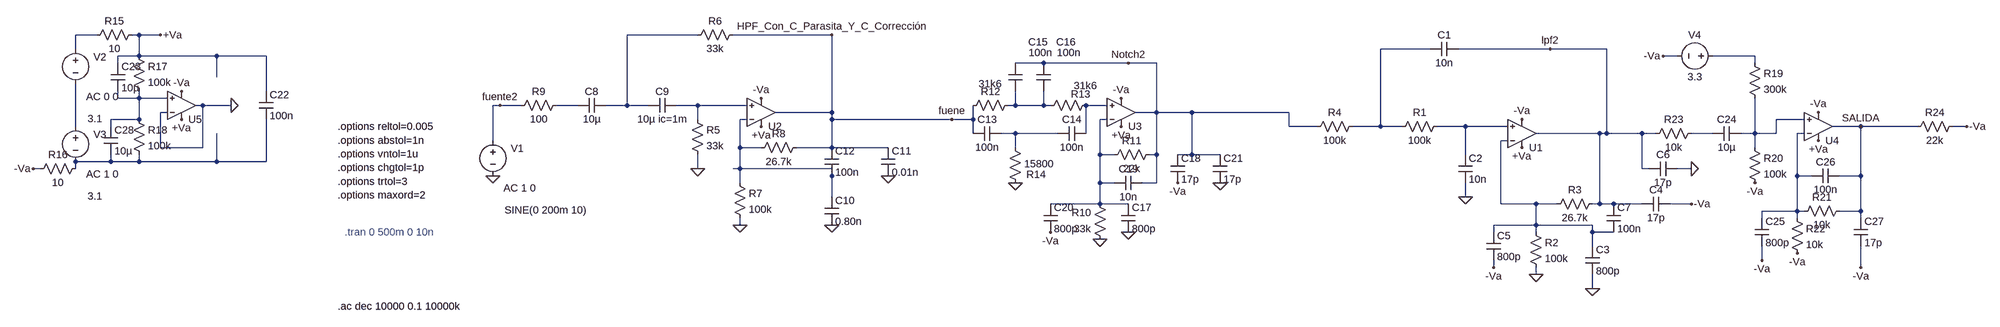
[diagram p0: schematic Draft2_porLaChita_Denuuevo_NoLepusiste_NOmBre_a_la_W_E_B_A_D_A.asc]
Draft2_porLaChita_Denuuevo_NoLepusiste_NOmBre_a_la_W_E_B_A_D_A.asc, the LTspice schematic file:
Version 4
SHEET 1 2632 900
WIRE -1760 -64 -1808 -64
WIRE -1664 -64 -1680 -64
WIRE -1616 -64 -1664 -64
WIRE -320 -64 -480 -64
WIRE -16 -64 -240 -64
WIRE -1808 -32 -1808 -64
WIRE 1360 -32 1248 -32
WIRE 1632 -32 1424 -32
WIRE 1760 -32 1632 -32
WIRE -1664 -16 -1664 -64
WIRE -1664 -16 -1712 -16
WIRE -1488 -16 -1664 -16
WIRE -1376 -16 -1488 -16
WIRE 1920 -16 1888 -16
WIRE 2096 -16 2000 -16
WIRE -1712 0 -1712 -16
WIRE 464 0 400 0
WIRE 656 0 464 0
WIRE 720 0 656 0
WIRE 2096 0 2096 -16
WIRE -1488 32 -1488 -16
WIRE -1376 64 -1376 -16
WIRE -1712 80 -1712 64
WIRE -1664 80 -1664 64
WIRE -1664 80 -1712 80
WIRE -1600 80 -1664 80
WIRE -1520 96 -1536 96
WIRE -1456 96 -1520 96
WIRE -768 96 -784 96
WIRE -720 96 -768 96
WIRE -592 96 -640 96
WIRE -480 96 -480 -64
WIRE -480 96 -528 96
WIRE -432 96 -480 96
WIRE -320 96 -368 96
WIRE -208 96 -320 96
WIRE 400 96 400 64
WIRE 400 96 384 96
WIRE 464 96 464 64
WIRE 464 96 400 96
WIRE 480 96 464 96
WIRE 608 96 560 96
WIRE -1600 112 -1616 112
WIRE -16 112 -16 -64
WIRE -16 112 -144 112
WIRE 720 112 720 0
WIRE 720 112 672 112
WIRE 800 112 720 112
WIRE 1040 112 800 112
WIRE -1664 128 -1664 80
WIRE -1664 128 -1728 128
WIRE -320 128 -320 96
WIRE -208 128 -224 128
WIRE -16 128 -16 112
WIRE 256 128 -16 128
WIRE 304 128 304 96
WIRE 304 128 256 128
WIRE 608 128 592 128
WIRE 2208 128 2144 128
WIRE -1808 144 -1808 48
WIRE -1728 144 -1728 128
WIRE 1040 144 1040 112
WIRE 1104 144 1040 144
WIRE 1248 144 1248 -32
WIRE 1248 144 1184 144
WIRE 1296 144 1248 144
WIRE 1440 144 1376 144
WIRE 1536 144 1440 144
WIRE 2336 144 2272 144
WIRE 2464 144 2336 144
WIRE 2576 144 2544 144
WIRE 304 160 304 128
WIRE 400 160 368 160
WIRE 496 160 400 160
WIRE 560 160 560 96
WIRE 1744 160 1600 160
WIRE 1760 160 1760 -32
WIRE 1760 160 1744 160
WIRE 1840 160 1760 160
WIRE 1872 160 1840 160
WIRE 2000 160 1952 160
WIRE 2096 160 2096 80
WIRE 2096 160 2064 160
WIRE 2144 160 2144 128
WIRE 2144 160 2096 160
WIRE 2208 160 2192 160
WIRE -784 176 -784 96
WIRE 1536 176 1520 176
WIRE -1616 192 -1616 112
WIRE -1520 192 -1520 96
WIRE -1520 192 -1616 192
WIRE -224 192 -224 128
WIRE -176 192 -224 192
WIRE -16 192 -16 128
WIRE -16 192 -96 192
WIRE 112 192 -16 192
WIRE 400 192 400 160
WIRE 2096 192 2096 160
WIRE 592 208 592 128
WIRE 624 208 592 208
WIRE 720 208 720 112
WIRE 720 208 704 208
WIRE 800 208 800 112
WIRE 800 208 768 208
WIRE 864 208 800 208
WIRE 1440 208 1440 144
WIRE -1728 224 -1728 208
WIRE -1728 224 -1808 224
WIRE -1664 224 -1664 208
WIRE -1664 224 -1728 224
WIRE -1488 224 -1488 160
WIRE -1488 224 -1664 224
WIRE -1376 224 -1376 128
WIRE -1376 224 -1488 224
WIRE -1888 240 -1904 240
WIRE -1808 240 -1808 224
WIRE -320 240 -320 208
WIRE -224 240 -224 192
WIRE -224 240 -240 240
WIRE -16 240 -224 240
WIRE 1840 240 1840 160
WIRE 1856 240 1840 240
WIRE 1952 240 1920 240
WIRE -16 256 -16 240
WIRE 2192 256 2192 160
WIRE 2224 256 2192 256
WIRE 2336 256 2336 144
WIRE 2336 256 2288 256
WIRE -224 272 -224 240
WIRE 592 272 592 208
WIRE 624 272 592 272
WIRE 720 272 720 208
WIRE 720 272 688 272
WIRE -16 304 -16 256
WIRE 1440 304 1440 272
WIRE 592 320 592 272
WIRE 592 320 480 320
WIRE 656 320 592 320
WIRE 1520 320 1520 176
WIRE 1600 320 1520 320
WIRE 1648 320 1600 320
WIRE 1744 320 1744 160
WIRE 1744 320 1728 320
WIRE 1776 320 1744 320
WIRE 1840 320 1776 320
WIRE 1952 320 1904 320
WIRE 2192 336 2192 256
WIRE 2192 336 2112 336
WIRE 2208 336 2192 336
WIRE 2336 336 2336 256
WIRE 2336 336 2288 336
WIRE 2112 352 2112 336
WIRE 2192 352 2192 336
WIRE 2336 352 2336 336
WIRE -224 368 -224 352
WIRE 1600 368 1600 320
WIRE 1600 368 1504 368
WIRE 1728 368 1600 368
WIRE 1504 384 1504 368
WIRE 1600 384 1600 368
WIRE 1728 384 1728 368
WIRE 1776 384 1728 384
WIRE 1728 416 1728 384
WIRE 2112 448 2112 416
WIRE 1504 464 1504 448
WIRE 2336 464 2336 416
WIRE 1600 480 1600 464
WIRE 1728 512 1728 480
FLAG 1568 192 +Va
FLAG 1568 128 -Va
FLAG 1440 304 0
FLAG 1600 480 0
FLAG 1632 -32 lpf2
FLAG 1728 512 0
FLAG 1952 320 -Va
FLAG 1952 240 0
FLAG 1504 464 -Va
FLAG -320 240 0
FLAG -176 144 +Va
FLAG -176 80 -Va
FLAG -16 -64 HPF_Con_C_Parasita_Y_C_Corrección
FLAG -224 368 0
FLAG -784 256 0
FLAG -768 96 fuente2
FLAG -16 368 0
FLAG 112 256 0
FLAG 592 400 0
FLAG 640 80 -Va
FLAG 640 144 +Va
FLAG 656 0 Notch2
FLAG 400 272 0
FLAG 256 128 fuene
FLAG 656 384 0
FLAG 864 272 0
FLAG 480 384 -Va
FLAG 768 272 -Va
FLAG -1456 96 0
FLAG -1904 240 -Va
FLAG -1616 -64 +Va
FLAG 2240 112 -Va
FLAG 2240 176 +Va
FLAG -1568 128 +Va
FLAG -1568 64 -Va
FLAG 2096 272 -Va
FLAG 1888 -16 -Va
FLAG 2112 448 -Va
FLAG 2192 432 -Va
FLAG 2336 144 SALIDA
FLAG 2576 144 -Va
FLAG 2336 464 -Va
SYMBOL res 1392 128 R90
WINDOW 0 0 56 VBottom 2
WINDOW 3 32 56 VTop 2
SYMATTR InstName R1
SYMATTR Value 100k
SYMBOL cap 1424 -48 R90
WINDOW 0 0 32 VBottom 2
WINDOW 3 32 32 VTop 2
SYMATTR InstName C1
SYMATTR Value 10n
SYMBOL cap 1424 208 R0
SYMATTR InstName C2
SYMATTR Value 10n
SYMBOL OpAmps\\UniversalOpAmp2 1568 160 M180
SYMATTR InstName U1
SYMBOL res 1584 368 R0
SYMATTR InstName R2
SYMATTR Value 100k
SYMBOL res 1744 304 R90
WINDOW 0 0 56 VBottom 2
WINDOW 3 32 56 VTop 2
SYMATTR InstName R3
SYMATTR Value 26.7k
SYMBOL cap 1712 416 R0
SYMATTR InstName C3
SYMATTR Value 800p
SYMBOL cap 1904 304 R90
WINDOW 0 0 32 VBottom 2
WINDOW 3 32 32 VTop 2
SYMATTR InstName C4
SYMATTR Value 17p
SYMBOL res 1200 128 R90
WINDOW 0 0 56 VBottom 2
WINDOW 3 32 56 VTop 2
SYMATTR InstName R4
SYMATTR Value 100k
SYMBOL cap 1488 384 R0
SYMATTR InstName C5
SYMATTR Value 800p
SYMBOL cap 1920 224 R90
WINDOW 0 0 32 VBottom 2
WINDOW 3 32 32 VTop 2
SYMATTR InstName C6
SYMATTR Value 17p
SYMBOL cap 1760 320 R0
SYMATTR InstName C7
SYMATTR Value 100n
SYMBOL cap -528 80 R90
WINDOW 0 0 32 VBottom 2
WINDOW 3 32 32 VTop 2
SYMATTR InstName C8
SYMATTR Value 10µ
SYMBOL cap -368 80 R90
WINDOW 0 0 32 VBottom 2
WINDOW 3 32 32 VTop 2
SYMATTR InstName C9
SYMATTR Value 10µ ic=1m
SYMBOL res -336 112 R0
SYMATTR InstName R5
SYMATTR Value 33k
SYMBOL res -224 -80 R90
WINDOW 0 0 56 VBottom 2
WINDOW 3 32 56 VTop 2
SYMATTR InstName R6
SYMATTR Value 33k
SYMBOL OpAmps\\UniversalOpAmp2 -176 112 M180
SYMATTR InstName U2
SYMBOL res -240 256 R0
SYMATTR InstName R7
SYMATTR Value 100k
SYMBOL res -80 176 R90
WINDOW 0 0 56 VBottom 2
WINDOW 3 32 56 VTop 2
SYMATTR InstName R8
SYMATTR Value 26.7k
SYMBOL voltage -784 160 R0
WINDOW 0 41 34 Left 2
WINDOW 123 24 124 Left 2
WINDOW 39 0 0 Left 0
WINDOW 3 27 174 Left 2
SYMATTR InstName V1
SYMATTR Value2 AC 1 0
SYMATTR Value SINE(0 200m 10)
SYMBOL res -624 80 R90
WINDOW 0 0 56 VBottom 2
WINDOW 3 32 56 VTop 2
SYMATTR InstName R9
SYMATTR Value 100
SYMBOL cap -32 304 R0
SYMATTR InstName C10
SYMATTR Value 0.80n
SYMBOL cap 96 192 R0
SYMATTR InstName C11
SYMATTR Value 0.01n
SYMBOL cap -32 192 R0
SYMATTR InstName C12
SYMATTR Value 100n
SYMBOL OpAmps\\UniversalOpAmp2 640 112 M180
SYMATTR InstName U3
SYMBOL res 608 416 R180
WINDOW 0 36 76 Left 2
WINDOW 3 36 40 Left 2
SYMATTR InstName R10
SYMATTR Value 33k
SYMBOL res 720 192 R90
WINDOW 0 0 56 VBottom 2
WINDOW 3 32 56 VTop 2
SYMATTR InstName R11
SYMATTR Value 22k
SYMBOL res 400 80 R90
WINDOW 0 0 56 VBottom 2
WINDOW 3 -48 57 VTop 2
SYMATTR InstName R12
SYMATTR Value 31k6
SYMBOL res 576 80 R90
WINDOW 0 6 28 VBottom 2
WINDOW 3 -44 17 VTop 2
SYMATTR InstName R13
SYMATTR Value 31k6
SYMBOL cap 368 144 R90
WINDOW 0 0 32 VBottom 2
WINDOW 3 32 32 VTop 2
SYMATTR InstName C13
SYMATTR Value 100n
SYMBOL cap 560 144 R90
WINDOW 0 0 32 VBottom 2
WINDOW 3 32 32 VTop 2
SYMATTR InstName C14
SYMATTR Value 100n
SYMBOL cap 384 0 R0
WINDOW 3 46 -24 Left 2
WINDOW 0 45 -48 Left 2
SYMATTR Value 100n
SYMATTR InstName C15
SYMBOL res 384 176 R0
WINDOW 0 41 77 Left 2
WINDOW 3 36 53 Left 2
SYMATTR InstName R14
SYMATTR Value 15800
SYMBOL cap 448 0 R0
WINDOW 3 46 -24 Left 2
WINDOW 0 45 -48 Left 2
SYMATTR Value 100n
SYMATTR InstName C16
SYMBOL cap 640 320 R0
SYMATTR InstName C17
SYMATTR Value 800p
SYMBOL cap 752 208 R0
SYMATTR InstName C18
SYMATTR Value 17p
SYMBOL cap 688 256 R90
WINDOW 0 0 32 VBottom 2
WINDOW 3 32 32 VTop 2
SYMATTR InstName C19
SYMATTR Value 10n
SYMBOL cap 464 320 R0
SYMATTR InstName C20
SYMATTR Value 800p
SYMBOL cap 848 208 R0
SYMATTR InstName C21
SYMATTR Value 17p
SYMBOL voltage -1808 -48 R0
WINDOW 0 41 34 Left 2
WINDOW 123 24 124 Left 2
WINDOW 39 0 0 Left 0
WINDOW 3 27 174 Left 2
SYMATTR InstName V2
SYMATTR Value2 AC 0 0
SYMATTR Value 3.1
SYMBOL voltage -1808 128 R0
WINDOW 0 41 34 Left 2
WINDOW 123 24 124 Left 2
WINDOW 39 0 0 Left 0
WINDOW 3 27 174 Left 2
SYMATTR InstName V3
SYMATTR Value2 AC 1 0
SYMATTR Value 3.1
SYMBOL res -1664 -80 R90
WINDOW 0 0 56 VBottom 2
WINDOW 3 32 56 VTop 2
SYMATTR InstName R15
SYMATTR Value 10
SYMBOL res -1792 224 R90
WINDOW 0 0 56 VBottom 2
WINDOW 3 32 56 VTop 2
SYMATTR InstName R16
SYMATTR Value 10
SYMBOL OpAmps\\UniversalOpAmp2 2240 144 M180
SYMATTR InstName U4
SYMBOL OpAmps\\UniversalOpAmp2 -1568 96 M180
SYMATTR InstName U5
SYMBOL res -1680 -32 R0
SYMATTR InstName R17
SYMATTR Value 100k
SYMBOL res -1680 112 R0
SYMATTR InstName R18
SYMATTR Value 100k
SYMBOL voltage 2016 -16 R90
WINDOW 0 -32 56 VBottom 2
WINDOW 3 32 56 VTop 2
WINDOW 123 0 0 Left 0
WINDOW 39 0 0 Left 0
SYMATTR InstName V4
SYMATTR Value 3.3
SYMBOL res 2080 -16 R0
SYMATTR InstName R19
SYMATTR Value 300k
SYMBOL res 2080 176 R0
SYMATTR InstName R20
SYMATTR Value 100k
SYMBOL cap 2064 144 R90
WINDOW 0 0 32 VBottom 2
WINDOW 3 32 32 VTop 2
SYMATTR InstName C24
SYMATTR Value 10µ
SYMBOL res 2304 320 R90
WINDOW 0 0 56 VBottom 2
WINDOW 3 32 56 VTop 2
SYMATTR InstName R21
SYMATTR Value 10k
SYMBOL res 2176 336 R0
SYMATTR InstName R22
SYMATTR Value 10k
SYMBOL cap 2096 352 R0
SYMATTR InstName C25
SYMATTR Value 800p
SYMBOL cap 2288 240 R90
WINDOW 0 0 32 VBottom 2
WINDOW 3 32 32 VTop 2
SYMATTR InstName C26
SYMATTR Value 100n
SYMBOL cap 2320 352 R0
SYMATTR InstName C27
SYMATTR Value 17p
SYMBOL res 1968 144 R90
WINDOW 0 0 56 VBottom 2
WINDOW 3 32 56 VTop 2
SYMATTR InstName R23
SYMATTR Value 10k
SYMBOL res 2560 128 R90
WINDOW 0 0 56 VBottom 2
WINDOW 3 32 56 VTop 2
SYMATTR InstName R24
SYMATTR Value 22k
SYMBOL cap -1392 64 R0
SYMATTR InstName C22
SYMATTR Value 100n
SYMBOL cap -1728 0 R0
SYMATTR InstName C23
SYMATTR Value 10µ
SYMBOL cap -1744 144 R0
SYMATTR InstName C28
SYMATTR Value 10µ
TEXT -1120 384 Left 2 ;.tran 0 500m 0 10n
TEXT -1136 144 Left 2 !.options reltol=0.005\n.options abstol=1n\n.options vntol=1u\n.options chgtol=1p\n.options trtol=3\n.options maxord=2
TEXT -1136 552 Left 2 !.ac dec 10000 0.1 10000k

The netlist it stands for:
* Draft2_porLaChita_Denuuevo_NoLepusiste_NOmBre_a_la_W_E_B_A_D_A.asc
R1 N014 N003 100k
C1 lpf2 N003 10n
C2 N014 0 10n
XU1 N014 N018 +Va -Va lpf2 level2 Avol=1Meg GBW=10Meg Slew=10Meg Ilimit=25m Rail=0 Vos=0 En=0 Enk=0 In=0 Ink=0 Rin=500Meg  ; pins In+ In- V+ V- OUT
R2 N018 0 100k
R3 lpf2 N018 26.7k
C3 N018 0 800p
C4 -Va lpf2 17p
R4 N003 Notch2 100k
C5 N018 -Va 800p
C6 0 lpf2 17p
C7 lpf2 N018 100n
C8 N002 N006 10µ
C9 N007 N002 10µ ic=1m
R5 N007 0 33k
R6 fuene N002 33k
XU2 N007 N010 +Va -Va fuene level2 Avol=1Meg GBW=10Meg Slew=10Meg Ilimit=25m Rail=0 Vos=0 En=0 Enk=0 In=0 Ink=0 Rin=500Meg  ; pins In+ In- V+ V- OUT
R7 N010 0 100k
R8 fuene N010 26.7k
V1 fuente2 0 SINE(0 200m 10) AC 1 0
R9 N006 fuente2 100
C10 N010 0 0.80n
C11 fuene 0 0.01n
C12 fuene N010 100n
XU3 N009 N011 +Va -Va Notch2 level2 Avol=1Meg GBW=10Meg Slew=10Meg Ilimit=25m Rail=0 Vos=0 En=0 Enk=0 In=0 Ink=0 Rin=500Meg  ; pins In+ In- V+ V- OUT
R10 0 N011 33k
R11 Notch2 N011 22k
R12 N008 fuene 31k6
R13 N009 N008 31k6
C13 N015 fuene 100n
C14 N009 N015 100n
C15 Notch2 N008 100n
R14 N015 0 15800
C16 Notch2 N008 100n
C17 N011 0 800p
C18 Notch2 -Va 17p
C19 Notch2 N011 10n
C20 N011 -Va 800p
C21 Notch2 0 17p
V2 N001 N013 3.1 AC 0 0
V3 N013 N019 3.1 AC 1 0
R15 +Va N001 10
R16 N019 -Va 10
XU4 N012 N017 +Va -Va SALIDA level2 Avol=1Meg GBW=10Meg Slew=10Meg Ilimit=25m Rail=0 Vos=0 En=0 Enk=0 In=0 Ink=0 Rin=500Meg  ; pins In+ In- V+ V- OUT
XU5 N005 0 +Va -Va 0 level2 Avol=1Meg GBW=10Meg Slew=10Meg Ilimit=25m Rail=0 Vos=0 En=0 Enk=0 In=0 Ink=0 Rin=500Meg  ; pins In+ In- V+ V- OUT
R17 +Va N005 100k
R18 N005 N019 100k
V4 N004 -Va 3.3
R19 N004 N012 300k
R20 N012 -Va 100k
C24 N012 N016 10µ
R21 SALIDA N017 10k
R22 N017 -Va 10k
C25 N017 -Va 800p
C26 SALIDA N017 100n
C27 SALIDA -Va 17p
R23 N016 lpf2 10k
R24 -Va SALIDA 22k
C22 +Va N019 100n
C23 +Va N005 10µ
C28 N005 N019 10µ
* .tran 0 500m 0 10n
.options reltol=0.005
.options abstol=1n
.options vntol=1u
.options chgtol=1p
.options trtol=3
.options maxord=2
.ac dec 10000 0.1 10000k
.lib UniversalOpAmp2.lib
.backanno
.end